# EAGLE schematic LR-CR (EAGLE 9.6.2)
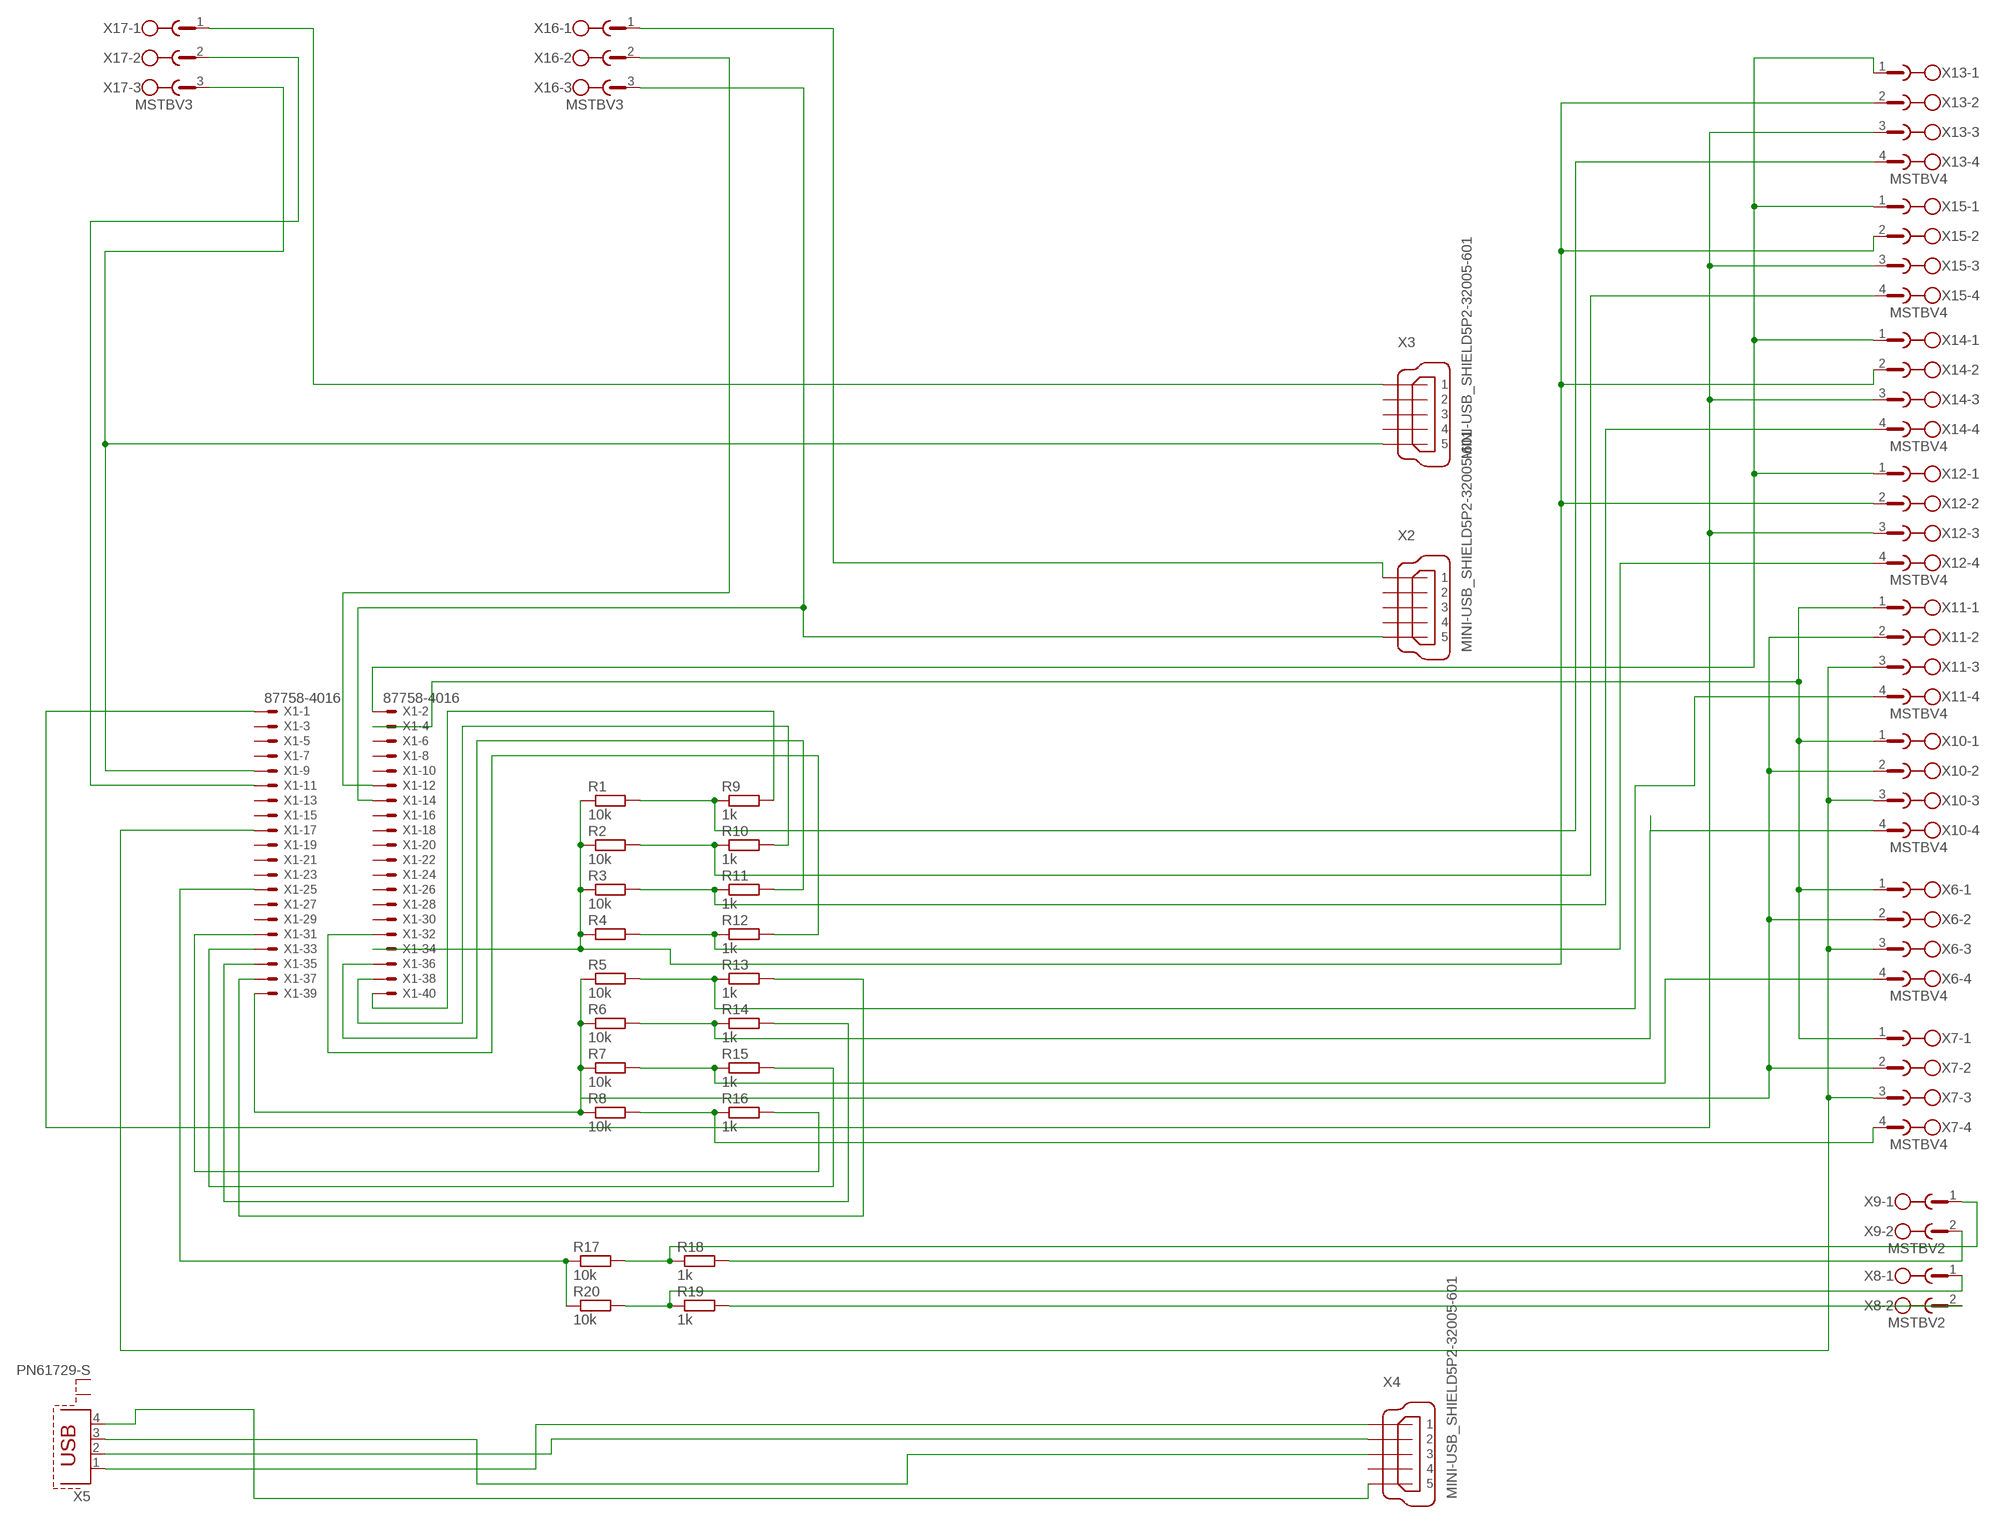
[diagram p0: schematic, sheet 1]

## Parts
R1  10k  R-EU_0411/15  [0411/15]
R2  10k  R-EU_0411/15  [0411/15]
R3  10k  R-EU_0411/15  [0411/15]
R4  R-EU_0411/15  [0411/15]
R5  10k  R-EU_0411/15  [0411/15]
R6  10k  R-EU_0411/15  [0411/15]
R7  10k  R-EU_0411/15  [0411/15]
R8  10k  R-EU_0411/15  [0411/15]
R9  1k  R-EU_0411/15  [0411/15]
R10  1k  R-EU_0411/15  [0411/15]
R11  1k  R-EU_0411/15  [0411/15]
R12  1k  R-EU_0411/15  [0411/15]
R13  1k  R-EU_0411/15  [0411/15]
R14  1k  R-EU_0411/15  [0411/15]
R15  1k  R-EU_0411/15  [0411/15]
R16  1k  R-EU_0411/15  [0411/15]
R17  10k  R-EU_0411/15  [0411/15]
R18  1k  R-EU_0411/15  [0411/15]
R19  1k  R-EU_0411/15  [0411/15]
R20  10k  R-EU_0411/15  [0411/15]
X1  87758-4016  [87758-4016]
X2  MINI-USB_SHIELD5P2-32005-601  [32005-601]
X3  MINI-USB_SHIELD5P2-32005-601  [32005-601]
X4  MINI-USB_SHIELD5P2-32005-601  [32005-601]
X5  PN61729-S  [PN61729-S]
X6  MSTBV4  [MSTBV4]
X7  MSTBV4  [MSTBV4]
X8  MSTBV2  [MSTBV2]
X9  MSTBV2  [MSTBV2]
X10  MSTBV4  [MSTBV4]
X11  MSTBV4  [MSTBV4]
X12  MSTBV4  [MSTBV4]
X13  MSTBV4  [MSTBV4]
X14  MSTBV4  [MSTBV4]
X15  MSTBV4  [MSTBV4]
X16  MSTBV3  [MSTBV3]
X17  MSTBV3  [MSTBV3]

## Nets
N$1: R1.1 R2.1 R3.1 R4.1 X1.34 X12.2 X13.2 X14.2 X15.2
N$2: R1.2 R9.1 X13.4
N$3: R5.1 R6.1 R7.1 R8.1 X1.39 X6.2 X7.2 X10.2 X11.2
N$4: R2.2 R10.1 X15.4
N$5: R3.2 R11.1 X14.4
N$6: R4.2 R12.1 X12.4
N$7: R5.2 R13.1 X11.4
N$8: R6.2 R14.1 X10.4
N$9: R7.2 R15.1 X6.4
N$10: R8.2 R16.1 X7.4
N$11: R9.2 X1.40
N$12: R10.2 X1.38
N$13: R11.2 X1.36
N$14: R12.2 X1.32
N$15: R13.2 X1.37
N$16: R14.2 X1.35
N$17: R15.2 X1.33
N$18: R16.2 X1.31
N$19: R17.1 R20.1 X1.25
N$20: R17.2 R18.1 X9.1
N$21: R19.1 R20.2 X8.1
N$22: R18.2 X9.2
N$23: R19.2 X8.2
N$24: X1.4 X6.1 X7.1 X10.1 X11.1
N$25: X1.12 X16.2
N$26: X1.14 X2.5 X16.3
N$27: X1.11 X17.2
N$28: X1.9 X3.5 X17.3
N$29: X4.1 X5.1
N$30: X4.2 X5.2
N$31: X4.3 X5.3
N$32: X4.5 X5.4
N$33: X1.17 X6.3 X7.3 X10.3 X11.3
N$34: X3.1 X17.1
N$35: X2.1 X16.1
N$36: X1.2 X12.1 X13.1 X14.1 X15.1
N$37: X1.1 X12.3 X13.3 X14.3 X15.3
Unconnected: X1.3 X1.5 X1.6 X1.7 X1.8 X1.10 X1.13 X1.15 X1.16 X1.18 X1.19 X1.20 X1.21 X1.22 X1.23 X1.24 X1.26 X1.27 X1.28 X1.29 X1.30 X2.2 X2.3 X2.4 X2.M1(S1) X2.M2(S2) X3.2 X3.3 X3.4 X3.M1(S1) X3.M2(S2) X4.4 X4.M1(S1) X4.M2(S2) X5.S1 X5.S2

## Library data of the parts
R1-R20 = rcl:R-EU_: RESISTOR, European symbol; SPICEPREFIX: R
X1 = con-molex:87758-4016: 40 Pin - 2mm Dual Row Single Wafer, Vertical T/H HDR Source: http://www.molex.com/pdm_docs/sd/877580616_sd.pdf; MF: MOLEX; MPN: 87758-4016; OC_FARNELL: unknown; OC_NEWARK: 25M5691
X2-X4 = con-cypressindustries:MINI-USB_SHIELD5P2-: MINI USB-B R/A DIP 5pol. Source: www.cypressindustries.com; OC_FARNELL: unknown; OC_NEWARK: unknown
X5 = con-berg:PN61729-S: BERG USB connector; OC_FARNELL: unknown; OC_NEWARK: unknown
X6 X7 X10-X15 = con-phoenix-508:MSTBV4: PHOENIX; MPN: MSTBV 2,5/4-GF-5.08; OC_FARNELL: 1792794; OC_NEWARK: 69R9847
X8 X9 = con-phoenix-508:MSTBV2: PHOENIX; MPN: MSTBV 2,5/2-GF-5.08; OC_FARNELL: 1792792; OC_NEWARK: 69R9845
X16 X17 = con-phoenix-508:MSTBV3: PHOENIX; MPN: MSTBV 2,5/3-GF-5.08; OC_FARNELL: 1792793; OC_NEWARK: 69R9846